# Altium schematic sheet MCU - Peripherals.SchDoc
size A4; SheetNumber: 2; SheetTotal: 2
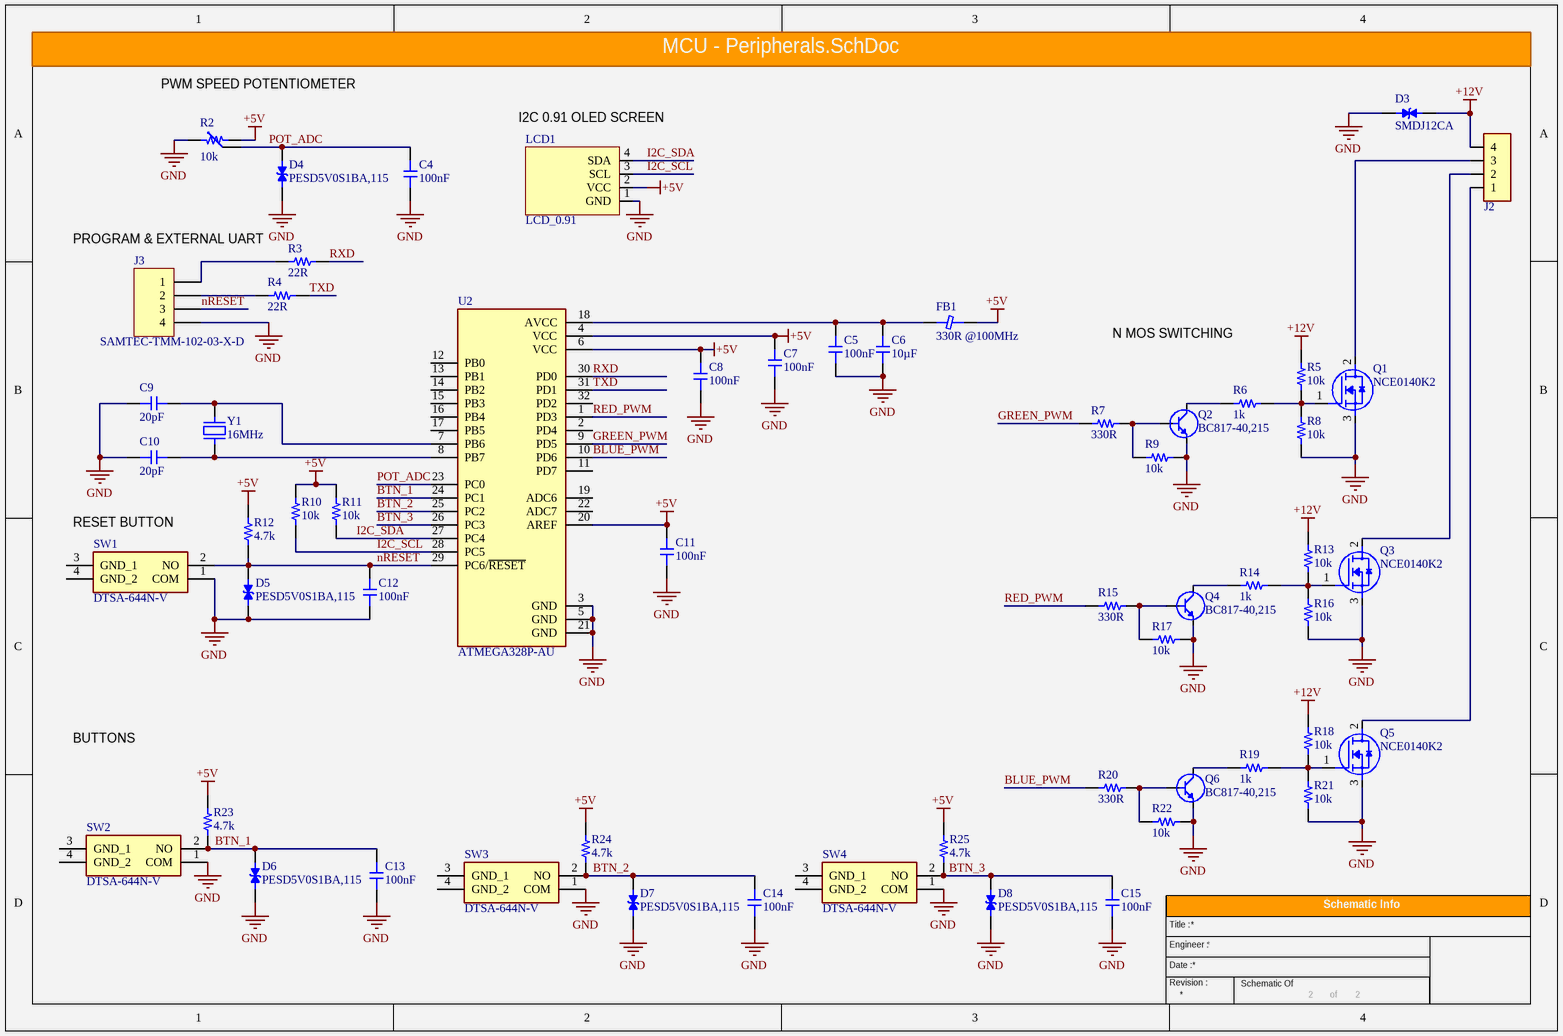
[diagram p0: MCU - Peripherals.SchDoc]

## Parts
C4  100nF  [0402_CAP]
C5  100nF  [0402_CAP]
C6  10µF  [0805]
C7  100nF  [0402_CAP]
C8  100nF  [0402_CAP]
C9  20pF  [0402_CAP]
C10  20pF  [0402_CAP]
C11  100nF  [0402_CAP]
C12  100nF  [0402_CAP]
C13  100nF  [0402_CAP]
C14  100nF  [0402_CAP]
C15  100nF  [0402_CAP]
D3  SMDJ12CA  [DIOM6859X262N]
D4  PESD5V0S1BA,115  [SOD323]
D5  PESD5V0S1BA,115  [SOD323]
D6  PESD5V0S1BA,115  [SOD323]
D7  PESD5V0S1BA,115  [SOD323]
D8  PESD5V0S1BA,115  [SOD323]
FB1  330R @100MHz  [Inductor-0805]
J2  691322310004  [691322310004]  (value not drawn)
J3  SAMTEC-TMM-102-03-X-D  [SAMTEC-TMM-102-03-X-D]
LCD1  LCD_0.91  [0_91-OLED]
Q1  NCE0140K2  [TO-252]
Q2  BC817-40,215  [BC81740215]
Q3  NCE0140K2  [TO-252]
Q4  BC817-40,215  [BC81740215]
Q5  NCE0140K2  [TO-252]
Q6  BC817-40,215  [BC81740215]
R2  10k  [POT_ROTARY]
R3  22R  [0402_RES]
R4  22R  [0402_RES]
R5  10k  [0402_RES]
R6  1k  [0402_RES]
R7  330R  [0402_RES]
R8  10k  [0402_RES]
R9  10k  [0402_RES]
R10  10k  [0402_RES]
R11  10k  [0402_RES]
R12  4.7k  [0402_RES]
R13  10k  [0402_RES]
R14  1k  [0402_RES]
R15  330R  [0402_RES]
R16  10k  [0402_RES]
R17  10k  [0402_RES]
R18  10k  [0402_RES]
R19  1k  [0402_RES]
R20  330R  [0402_RES]
R21  10k  [0402_RES]
R22  10k  [0402_RES]
R23  4.7k  [0402_RES]
R24  4.7k  [0402_RES]
R25  4.7k  [0402_RES]
SW1  DTSA-644N-V  [DTSA644NV]
SW2  DTSA-644N-V  [DTSA644NV]
SW3  DTSA-644N-V  [DTSA644NV]
SW4  DTSA-644N-V  [DTSA644NV]
U2  ATMEGA328P-AU  [QFP80P900X900X120-32N]
Y1  16MHz  [HC49S]

## Nets
+5V: C7.2 C8.2 C11.2 FB1.2 LCD1.2(VCC) R2.1 R10.2 R11.2 R12.2 R23.1 R24.1 R25.1 U2.4(VCC) U2.6(VCC) U2.20(AREF)
+12V: D3.1 J2.4 R5.2 R13.2 R18.2
GND: C4.1 C5.1 C6.1 C7.1 C8.1 C9.2 C10.2 C11.1 C12.1 C13.1 C14.1 C15.1 D3.2 D4.A D5.A D6.A D7.A D8.A J3.4 LCD1.1(GND) Q1.3(S) Q2.2(E) Q3.3(S) Q4.2(E) Q5.3(S) Q6.2(E) R2.3 R8.1 R9.1 R16.1 R17.1 R21.1 R22.1 SW1.1(COM) SW2.1(COM) SW3.1(COM) SW4.1(COM) U2.3(GND) U2.5(GND) U2.21(GND)
BLUE_PWM: R20.1 U2.10(PD6)
BTN_1: C13.2 D6.C R23.2 SW2.2(NO) U2.24(PC1)
BTN_2: C14.2 D7.C R24.2 SW3.2(NO) U2.25(PC2)
BTN_3: C15.2 D8.C R25.2 SW4.2(NO) U2.26(PC3)
GREEN_PWM: R7.1 U2.9(PD5)
I2C_SCL: LCD1.3(SCL) R10.1 U2.28(PC5)
I2C_SDA: LCD1.4(SDA) R11.1 U2.27(PC4)
nRESET: C12.2 D5.C J3.3 R12.1 SW1.2(NO) U2.29(PC6/~{RESET})
POT_ADC: C4.2 D4.C R2.2 U2.23(PC0)
RED_PWM: R15.1 U2.1(PD3)
RXD: R3.2 U2.30(PD0)
TXD: R4.2 U2.31(PD1)
NetC5_2: C5.2 C6.2 FB1.1 U2.18(AVCC)
NetC9_1: C9.1 U2.7(PB6) Y1.2
NetC10_1: C10.1 U2.8(PB7) Y1.1
NetJ2_1: J2.1 Q5.2(D)
NetJ2_2: J2.2 Q3.2(D)
NetJ2_3: J2.3 Q1.2(D)
NetJ3_1: J3.1 R3.1
NetJ3_2: J3.2 R4.1
NetQ1_1: Q1.1(G) R5.1 R6.2 R8.2
NetQ2_1: Q2.1(B) R7.2 R9.2
NetQ2_3: Q2.3(C) R6.1
NetQ3_1: Q3.1(G) R13.1 R14.2 R16.2
NetQ4_1: Q4.1(B) R15.2 R17.2
NetQ4_3: Q4.3(C) R14.1
NetQ5_1: Q5.1(G) R18.1 R19.2 R21.2
NetQ6_1: Q6.1(B) R20.2 R22.2
NetQ6_3: Q6.3(C) R19.1

Not connected (* = marked no-connect by the designer): SW1 3(GND_1) 4(GND_2); SW2 3(GND_1) 4(GND_2); SW3 3(GND_1) 4(GND_2); SW4 3(GND_1) 4(GND_2); U2 2(PD4) 11(PD7) 12(PB0) 13(PB1) 14(PB2) 15(PB3) 16(PB4) 17(PB5) 19(ADC6) 22(ADC7) 32(PD2)

## Notes on the sheet
- PWM SPEED POTENTIOMETER
- (near LCD1) I2C 0.91 OLED SCREEN
- PROGRAM & EXTERNAL UART
- N MOS SWITCHING
- (near SW1) RESET BUTTON
- BUTTONS
- Schematic Info
- Title :
- Engineer :
- Date :
- Revision :
- Schematic Of
- of

## Library data of the parts
C4 C5 C7 C8 C11-C15 = CL05B104KO5NNNC: MLCC (1005) 0402 100nF 16VDC ±10% X7R
C6 = GRM21BC8YA106KE11L_1: MLCC (2012) 0805 10uF 35VDC ±10% X6S
C9 C10 = CL05C200JB5NNNC: MLCC (1005) 0402 20pF 50VDC ±5% C0G (NP0)
D3 = SMDJ12CA: 150.8A 14.7V 12V SMC ESD and Surge Protection (TVS/ESD) ROHS; MP: SMDJ36CA; Price: None; Availability: Unavailable; Value: *; Package: None
D4-D8 = PESD5V0S1BA,115: 12A 130W 14V 5.5V Bidirectional 5V SOD-323 ESD and Surge Protection (TVS/ESD) ROHS; Manufacturer_Name: Lite-On; Manufacturer_Part_Number: LTST-C190KRKT; Datasheet Link: https://componentsearchengine.com/Datasheets/1/LTST-C190KRKT.pdf; Height: 0.8mm; Mouser Part Number: 859-LTST-C190KRKT; Mouser Price/Stock: https://www.mouser.co.uk/ProductDetail/Lite-On/LTST-C190KRKT?qs=kAD5fFa1n5VY3YYNWPC1Fg%3D%3D; Arrow Part Number: LTST-C190KRKT; Arrow Price/Stock: https://www.arrow.com/en/products/ltst-c190krkt/lite-on-technology?region=europe
FB1 = LCB2012-152Y-N: FERRITE BEAD 0603 330R/100MHZ SMD
J2 = 691322310004: WURTH 3.81MM Terminal Block 691322310004
J3 = SAMTEC-TMM-102-03-X-D: CONN HEADER VERT 4POS 2MM; Package: None; Price: None; Value: *; MP: SAMTEC-TMM-102-03-X-D; Availability: Unavailable
Q1 Q3 Q5 = NCE0140K2: 100V 40A 17mΩ@10V,28A 140W 3V 1 N-channel TO-252 MOSFETs ROHS; Height: 2.38mm
Q2 Q4 Q6 = BC817-40,215: 0.5A 45V BJT NPN Transistor SOT23 SMD; Manufacturer_Name: Nexperia; Datasheet Link: https://assets.nexperia.com/documents/data-sheet/BC817_SER.pdf; Height: 1.1mm; Manufacturer_Part_Number: BC817-40,215; Mouser Part Number: 771-BC817-40-T/R; Mouser Price/Stock: https://www.mouser.co.uk/ProductDetail/Nexperia/BC817-40215?qs=me8TqzrmIYU%252B245p8hOLaQ%3D%3D; Arrow Part Number: BC817-40,215; Arrow Price/Stock: https://www.arrow.com/en/products/bc817-40215/nexperia?region=nac
R2 = Rotary Generic Potentiometer: 10k DIP
R3 R4 = AC0402FR-0722RL: RES.(1005) 0402 22 Ohms 1% 1/16W AEC-Q200
R5 R8-R11 R13 R16-R18 R21 R22 = AC0402FR-0710KL: RES.(1005) 0402 10K Ohms 1% 1/16W
R6 R14 R19 = AC0402FR-071KL: RES.(1005) 0402 1K Ohms 1% 1/16W 100PPM AEC-Q200 S
R7 R15 R20 = CRCW0402330RFKTDBC: RES.(1005) 0402 330 Ohms 1% 1/16W 100PPM
R12 R23-R25 = AC0402FR-074K7L: RES.(1005) 0402 4.7K Ohms 1% 1/16W 100PPM AEC-Q200
SW1-SW4 = DTSA-644N-V: Button DIP; Manufacturer_Name: Diptronics; Datasheet Link: https://ru.mouser.com/ProductDetail/Diptronics/DTSA-644N-V?qs=gTYE2QTfZfTLDusQpQJufA%3D%3D; Height: 8mm; Manufacturer_Part_Number: DTSA-644N-V; Mouser Part Number: 113-DTSA-644N-V; Mouser Price/Stock: https://www.mouser.co.uk/ProductDetail/Diptronics/DTSA-644N-V?qs=gTYE2QTfZfTLDusQpQJufA%3D%3D
U2 = ATMEGA328P-AU: AVR AVRÂ® ATmega Microcontroller IC 8-Bit 20MHz 32KB (16K x 16) FLASH 32-TQFP (7x7); MF: Microchip; SnapEDA_Link: https://www.snapeda.com/parts/ATMEGA328P-AU/Microchip/view-part/?ref=snap; Package: TQFP-32 Microchip; Value: *; MP: ATMEGA328P-AU; Check_prices: https://www.snapeda.com/parts/ATMEGA328P-AU/Microchip/view-part/?ref=eda
Y1 = AS49SD-16M-FE200F3: CRYSTAL 16MHz 20pF SMD